# Altium project MidaSatsEXP.PrjPcb
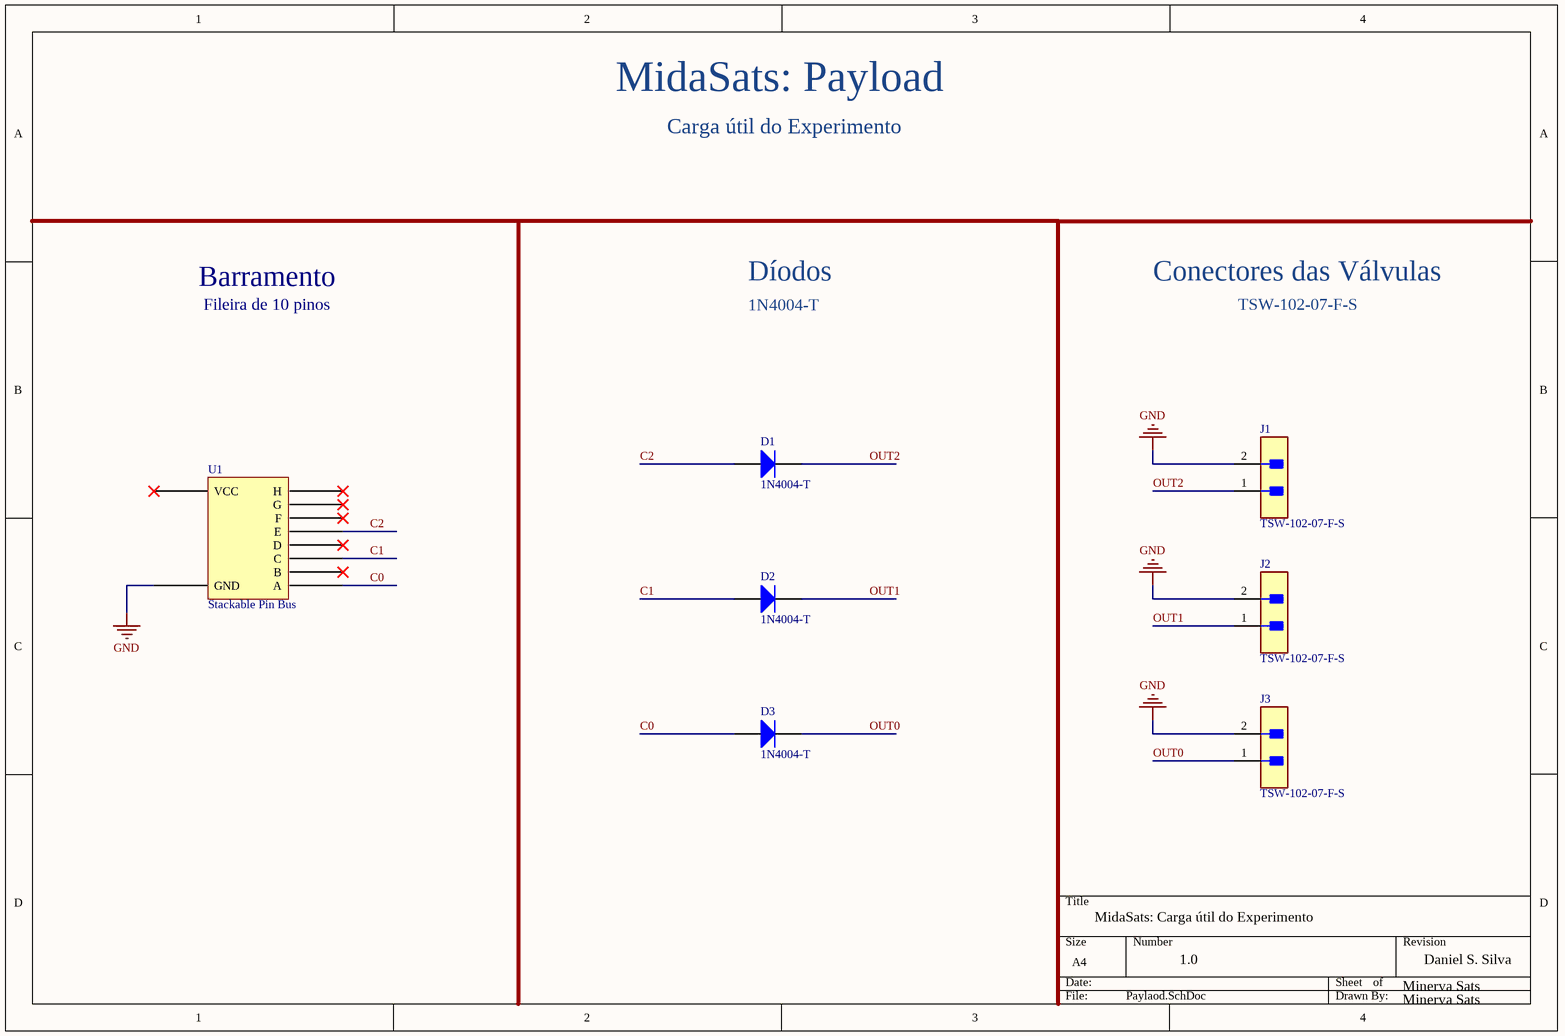
[diagram p0: Paylaod.SchDoc]
1 sheet, 7 parts. Net scope: global (net labels, ports and power ports of the same name join across sheets).
Board file: Paylaod.PcbDoc

## Sheet Paylaod.SchDoc
size A4; SheetNumber: 1; SheetTotal: 1

### Parts
D1  1N4004-T  [DIOD-DO-41-P-2_V]
D2  1N4004-T  [DIOD-DO-41-P-2_V]
D3  1N4004-T  [DIOD-DO-41-P-2_V]
J1  TSW-102-07-F-S  [FP-TSW-102-07-F-S-MFG]
J2  TSW-102-07-F-S  [FP-TSW-102-07-F-S-MFG]
J3  TSW-102-07-F-S  [FP-TSW-102-07-F-S-MFG]
U1  Stackable Pin Bus  [STACKABLE_PIN_BUS]

### Nets
GND: J1.2 J2.2 J3.2 U1.2(GND)
C0: D3.1(A) U1.3(A)
C1: D2.1(A) U1.5(C)
C2: D1.1(A) U1.7(E)
OUT0: D3.2(K) J3.1
OUT1: D2.2(K) J2.1
OUT2: D1.2(K) J1.1

Not connected (* = marked no-connect by the designer): U1 1(VCC)* 4(B)* 6(D)* 8(F)* 9(G)* 10(H)*

### Notes on the sheet
- MidaSats: Payload
- Carga útil do Experimento
- Barramento
- Fileira de 10 pinos
- Díodos
- 1N4004-T
- Conectores das Válvulas
- TSW-102-07-F-S
- MidaSats: Carga útil do Experimento
- 1.0
- Minerva Sats
- Daniel S. Silva

### Library data of the parts
D1-D3 = CMP-0639-00014-2: 1.0 A Rectifier, 15 pF, 400 V, -65 to 150 degC, 2-Pin DO-41 Plastic, RoHS, Tape and Reel; Manufacturer: Diodes Inc; VF (V): 1; Max. IR (uA): 5; Max. IFSM (A): 30; VRRM (V): 400; CT (pF): 15; ComponentLink2Description: Datasheet; PackageReference: DO-41-P-2; Packing: Tape and Reel; DatasheetVersion: Rev. 8-2; Operating Temperature Range (degC): -65 to 150; ComponentLink2URL: http://diodes.com/datasheets/ds28002.pdf; PackageDescription: 2-Pin Axial Lead, Body 4.635 x 2.36 mm, Lead Spread 25.4 mm; PartNumber: 1N4004-T; ComponentLink1Description: Manufacturer URL; Mounting Technology: Through Hole; Max. Average Rectified Current IO (A): 1; RoHS: TRUE; ComponentLink1URL: http://diodes.com/
J1-J3 = CMP-02766-001458-1: CONN HEADER VERT 2POS 2.54MM; Gender: Male; Max Current Rating: 7.6A; Number of Contacts: 2; Max Voltage Rating (AC): 550V; Orientation: Straight; Depth: 2.54mm; Series: TSW; Package Quantity: 1; Min Operating Temperature: -55°C; Max Operating Temperature: 125°C; Contact Type: Male Pin; Contact Shape: Square; Color: Black; Housing Color: Black; Connector Type: Header; Fastening Type: Pull; Radiation Hardening: No; Pitch: 2.54mm; Housing Material: Polyester; Mount: Through Hole; Number of Positions: 2; Number of Rows: 1; Contact Material: Bronze; Insulation Color: Black; Contact Finish - Mating: GOLD; Termination: Solder; Insulation Material: PBT; Length: 5.08mm; Flammability Rating: UL94 V-0; Contact Mating Length: 0.23inch; REACH SVHC: No SVHC; Contact Plating: Gold; RoHS Compliant: Yes; Packaging: Bulk
U1 = Barramento Empilhável: 10 pinos, Passo 2.54mm, Dimensões da barra 26x2x8mm